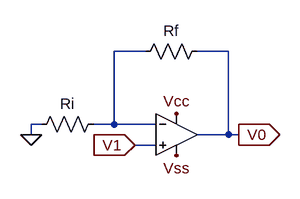
[diagram p0: schematic Lab_1_Circ_3_NI.asc]
Lab_1_Circ_3_NI.asc, the LTspice schematic file:
Version 4
SHEET 1 1560 680
WIRE 176 -208 128 -208
WIRE 304 -208 256 -208
WIRE 16 -96 0 -96
WIRE 128 -96 128 -208
WIRE 128 -96 96 -96
WIRE 192 -96 128 -96
WIRE 0 -80 0 -96
WIRE 304 -80 304 -208
WIRE 304 -80 256 -80
WIRE 320 -80 304 -80
WIRE 192 -64 160 -64
FLAG 0 -80 0
FLAG 224 -112 Vcc
FLAG 224 -48 Vss
FLAG 160 -64 V1
IOPIN 160 -64 In
FLAG 320 -80 V0
IOPIN 320 -80 Out
SYMBOL OpAmps\\opamp2 224 -144 R0
WINDOW 0 16 32 Invisible 2
WINDOW 3 16 96 Invisible 2
SYMATTR InstName U1
SYMATTR Value LM324
SYMBOL res 160 -192 R270
WINDOW 0 32 56 VTop 2
WINDOW 3 0 56 VBottom 2
SYMATTR InstName Rf
SYMATTR Value ""
SYMBOL res 112 -112 R90
WINDOW 0 0 56 VBottom 2
WINDOW 3 32 56 VTop 2
SYMATTR InstName Ri
SYMATTR Value ""

The netlist it stands for:
* Lab_1_Circ_3_NI.asc
XU1 V1 N001 Vcc Vss V0 LM324  ; pins In+ In- V+ V- OUT
Rf N001 V0
Ri N001 0
.backanno
.end